# Altium schematic sheet 51小车.SchDoc
size A3
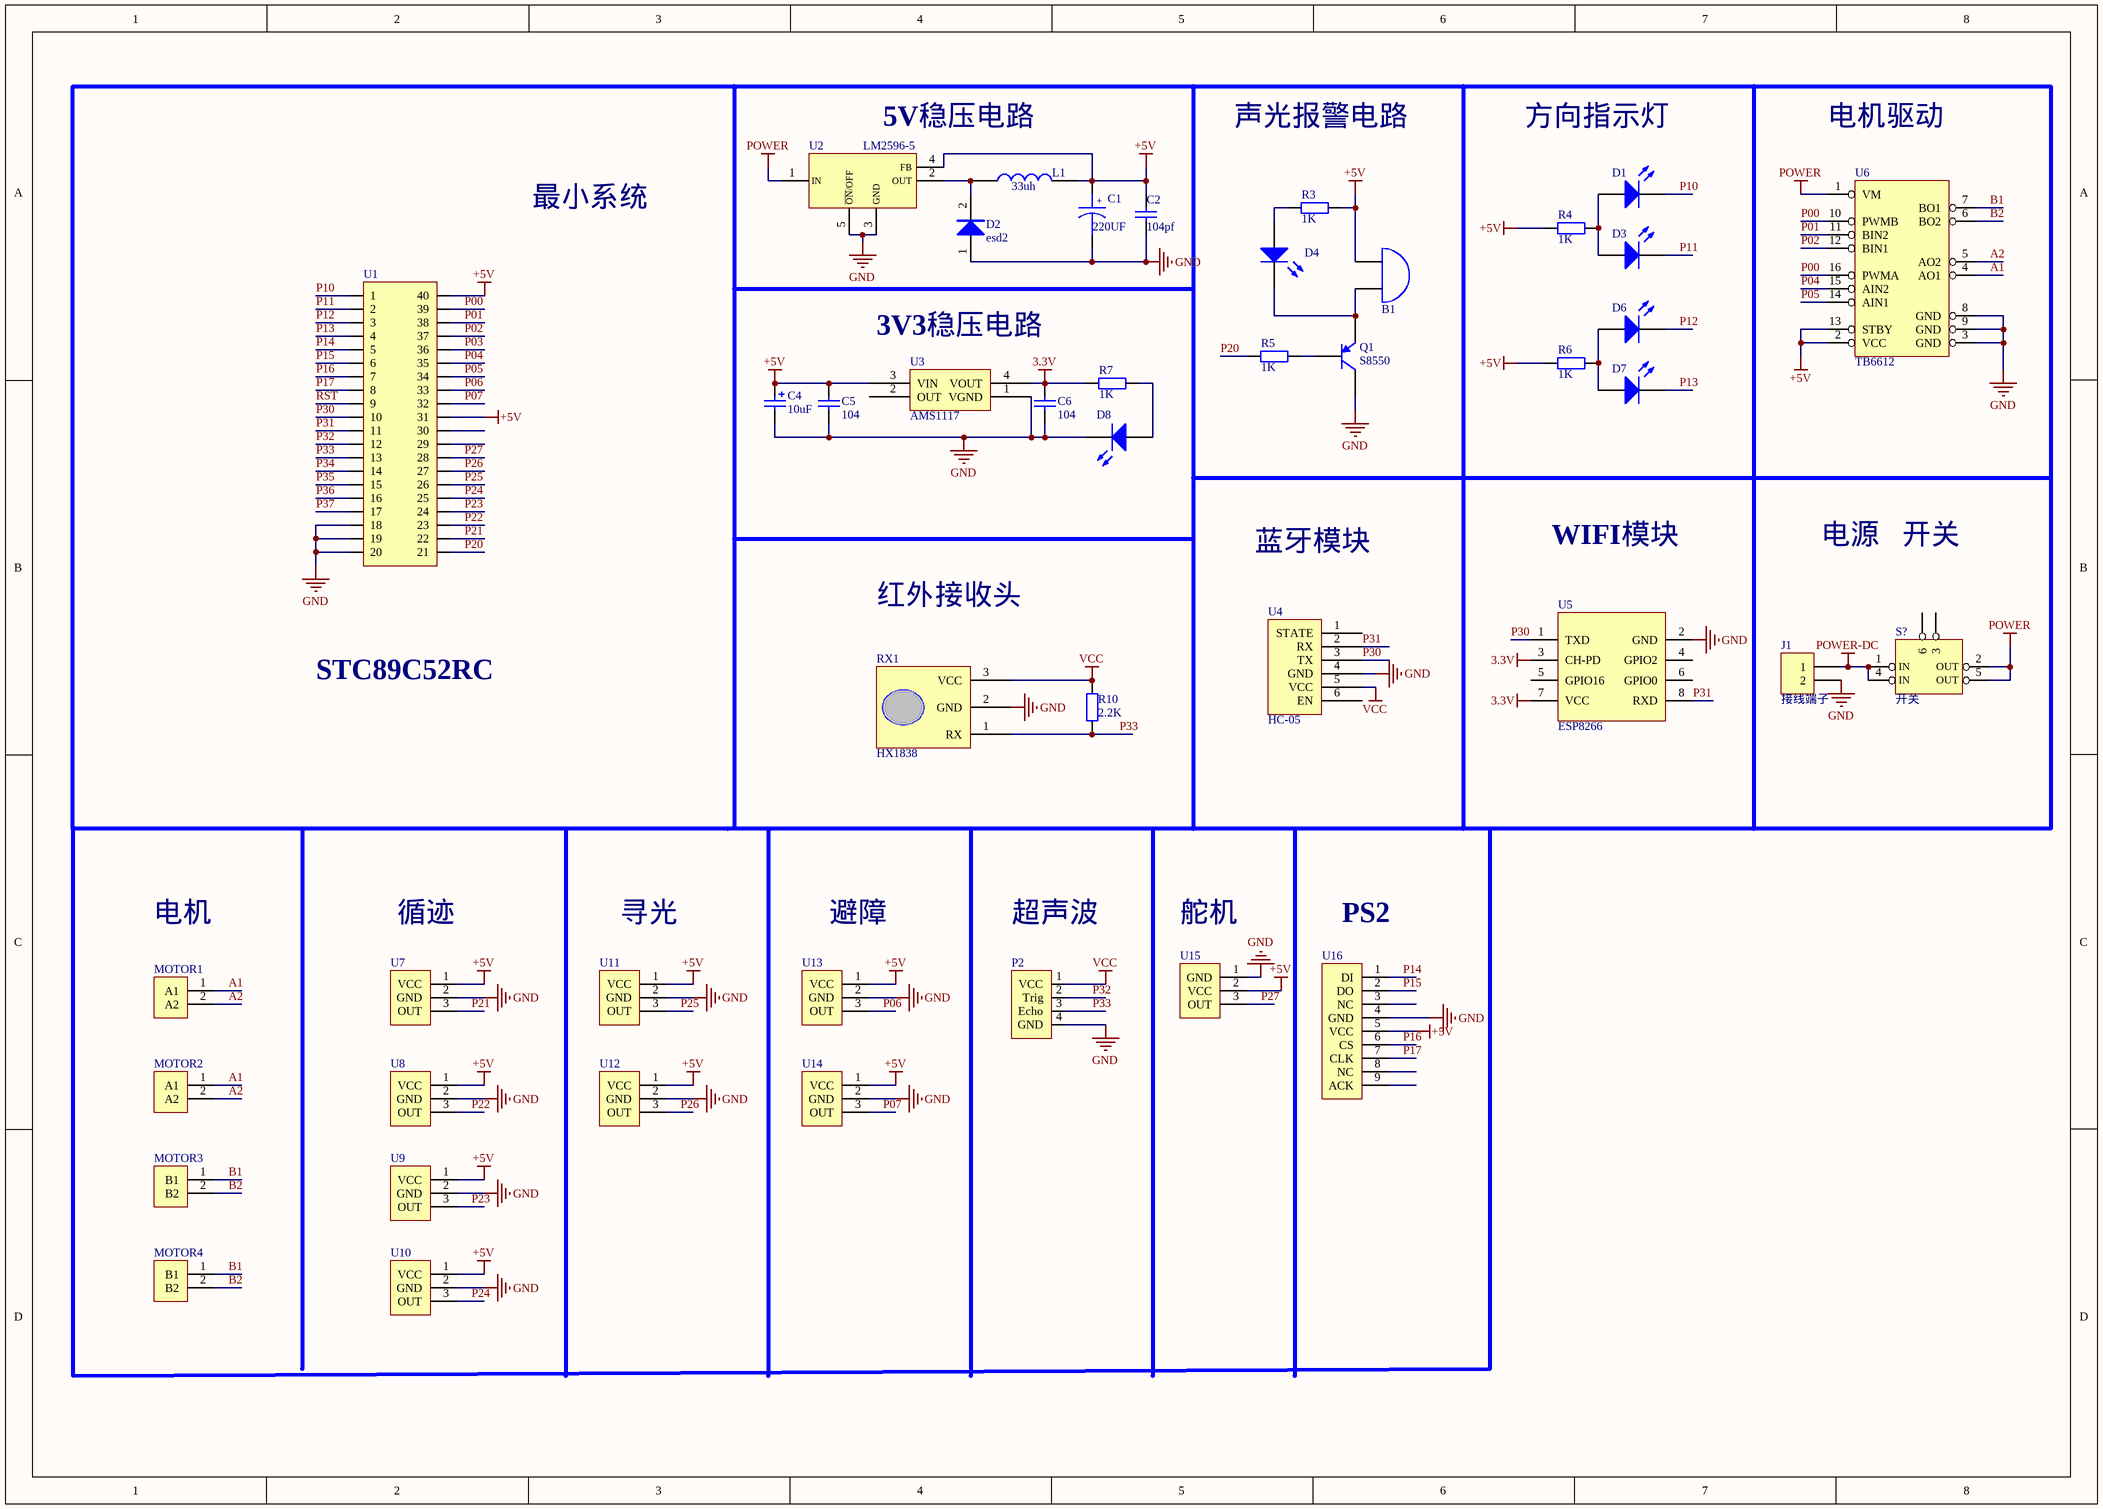
[diagram p0: 51小车.SchDoc]

## Parts
B1  5V有源蜂鸣器  [BEEP 7.6x12x7.5]  (value not drawn)
C1  CAP4 电解电容  [CAP6.3]  (value not drawn)
C2  Cap  [C 0603_L]  (value not drawn)
C4  value 10uF  [CAP 1.5*4*8 - BK]  (hidden comment: 10uf电解电容)
C5  value 104  [CC 2.2*5]  (hidden comment: 104瓷片电容)
C6  value 104  [CC 2.2*5]  (hidden comment: 104瓷片电容)
D1  3mm红色LED  [LED 3MM-R]  (value not drawn)
D2  esd2  [SMA]
D3  3mm红色LED  [LED 3MM-R]  (value not drawn)
D4  3mm蓝色LED  [LED 3MM-R]  (value not drawn)
D6  3mm红色LED  [LED 3MM-R]  (value not drawn)
D7  3mm红色LED  [LED 3MM-R]  (value not drawn)
D8  3mm红色LED  [LED 3MM-R]  (value not drawn)
J1  接线端子
L1  INDUCTOR 0  [CDRH74]  (value not drawn)
MOTOR1  2P端子  [XH2.54-WI-2P]  (value not drawn)
MOTOR2  2P端子  [XH2.54-WI-2P]  (value not drawn)
MOTOR3  2P端子  [XH2.54-WI-2P]  (value not drawn)
MOTOR4  2P端子  [XH2.54-WI-2P]  (value not drawn)
P2  超声波  [HDR2.54-M-LI-4P]  (value not drawn)
Q1  S8550  [TO92B]
R3  value 1K  [AXIAL0.4-1/4W]  (hidden comment: 1K直插色环电阻)
R4  value 1K  [AXIAL0.4-1/4W]  (hidden comment: 1K直插色环电阻)
R5  value 1K  [AXIAL0.4-1/4W]  (hidden comment: 1K直插色环电阻)
R6  value 1K  [AXIAL0.4-1/4W]  (hidden comment: 1K直插色环电阻)
R7  value 1K  [AXIAL0.4-1/4W]  (hidden comment: 1K直插色环电阻)
R10  value 2.2K  [AXIAL0.4-1/4W]  (hidden comment: 2.2K直插色环电阻)
RX1  HX1838  [TO92B]
S?  开关  [SWITCH_SELFLOCKING]
U1  40  (value not drawn)
U2  LM2596-5  [TO263-5A]
U3  AMS1117
U4  HC-05  [HDR2.54-M-LI-6P]
U5  ESP8266
U6  TB6612  [TB6612]
U7  红外避障模块  [HDR2.54-LI-3P]  (value not drawn)
U8  红外避障模块  [HDR2.54-LI-3P]  (value not drawn)
U9  红外避障模块  [HDR2.54-LI-3P]  (value not drawn)
U10  红外避障模块  [HDR2.54-LI-3P]  (value not drawn)
U11  红外避障模块  [HDR2.54-LI-3P]  (value not drawn)
U12  红外避障模块  [HDR2.54-LI-3P]  (value not drawn)
U13  红外避障模块  [HDR2.54-LI-3P]  (value not drawn)
U14  红外避障模块  [HDR2.54-LI-3P]  (value not drawn)
U15  舵机  (value not drawn)
U16  PS2  (value not drawn)

## Nets
3.3V: C6.2 R7.2 U3.4(VOUT) U5.3(CH-PD) U5.7(VCC)
+5V: B1.1(A) C1.1 C2.2 C4.1 C5.2 L1.2 R3.1 R4.2 R6.2 U1.31 U1.40 U2.4(FB) U3.3(VIN) U6.2(VCC) U6.13(STBY) U7.1(VCC) U8.1(VCC) U9.1(VCC) U10.1(VCC) U11.1(VCC) U12.1(VCC) U13.1(VCC) U14.1(VCC) U15.2(VCC) U16.5(VCC)
GND: C1.2 C2.1 C4.2 C5.1 C6.1 D2.1 D8.2(K) J1.2 P2.4(GND) Q1.2(C) RX1.2(GND) U1.18 U1.19 U1.20 U2.3(GND) U2.5(~{ON}/OFF) U3.1(VGND) U4.4(GND) U5.2(GND) U6.3(GND) U6.8(GND) U6.9(GND) U7.2(GND) U8.2(GND) U9.2(GND) U10.2(GND) U11.2(GND) U12.2(GND) U13.2(GND) U14.2(GND) U15.1(GND) U16.4(GND)
POWER: S?.2(OUT) S?.5(OUT) U2.1(IN) U6.1(VM)
POWER-DC: J1.1 S?.1(IN) S?.4(IN)
VCC: P2.1(VCC) R10.2 RX1.3(VCC) U4.5(VCC)
A1: MOTOR1.1(A1) MOTOR2.1(A1) U6.4(AO1)
A2: MOTOR1.2(A2) MOTOR2.2(A2) U6.5(AO2)
B1: MOTOR3.1(B1) MOTOR4.1(B1) U6.7(BO1)
B2: MOTOR3.2(B2) MOTOR4.2(B2) U6.6(BO2)
P00: U1.39 U6.10(PWMB) U6.16(PWMA)
P01: U1.38 U6.11(BIN2)
P02: U1.37 U6.12(BIN1)
P03: U1.36
P04: U1.35 U6.15(AIN2)
P05: U1.34 U6.14(AIN1)
P06: U1.33 U13.3(OUT)
P07: U1.32 U14.3(OUT)
P10: D1.2(K) U1.1
P11: D3.2(K) U1.2
P12: D6.2(K) U1.3
P13: D7.2(K) U1.4
P14: U1.5 U16.1(DI)
P15: U1.6 U16.2(DO)
P16: U1.7 U16.6(CS)
P17: U1.8 U16.7(CLK)
P20: R5.2 U1.21
P21: U1.22 U7.3(OUT)
P22: U1.23 U8.3(OUT)
P23: U1.24 U9.3(OUT)
P24: U1.25 U10.3(OUT)
P25: U1.26 U11.3(OUT)
P26: U1.27 U12.3(OUT)
P27: U1.28 U15.3(OUT)
P30: U1.10 U4.3(TX) U5.1(TXD)
P31: U1.11 U4.2(RX) U5.8(RXD)
P32: P2.2(Trig) U1.12
P33: P2.3(Echo) R10.1 RX1.1(RX) U1.13
P34: U1.14
P35: U1.15
P36: U1.16
P37: U1.17
RST: U1.9
NetB1_2: B1.2(B) D4.2(K) Q1.3(E)
NetD1_1: D1.1(A) D3.1(A) R4.1
NetD2_2: D2.2 L1.1 U2.2(OUT)
NetD4_1: D4.1(A) R3.2
NetD6_1: D6.1(A) D7.1(A) R6.1
NetD8_1: D8.1(A) R7.1
NetQ1_1: Q1.1(B) R5.1

Not connected (* = marked no-connect by the designer): S? 3 6; U1 29 30; U3 2(OUT); U4 1(STATE) 6(EN); U5 4(GPIO2) 5(GPIO16) 6(GPIO0); U16 3(NC) 8(NC) 9(ACK)

## Notes on the sheet
- 5V稳压电路
- 声光报警电路
- 方向指示灯
- 电机驱动
- 最小系统
- (near U3) 3V3稳压电路
- 蓝牙模块
- WIFI模块
- 电源   开关
- 红外接收头
- STC89C52RC
- 电机
- 循迹
- 寻光
- 避障
- 超声波
- (near U15) 舵机
- (near U16) PS2
- (in symbol Cap) 104pf
- (in symbol CAP4 电解电容) +; 220UF
- (in symbol INDUCTOR 0) 33uh

## Library data of the parts
B1 = BELL
C1 = CAP4 电解电容: Capacitor
C2 C5 C6 = Cap: Capacitor; Published: 8-Jun-2000; LatestRevisionDate: 17-Jul-2002; LatestRevisionNote: Re-released for DXP Platform.; PackageReference: RAD-0.3; Publisher: Altium Limited
  C5 C6: PackageDescription: Radial Cap, Thru-Hole; 2 Leads; 0.3 in Pin Spacing
C4 = Cap Pol2: Polarized Capacitor (Axial); Published: 8-Jun-2000; LatestRevisionDate: 17-Jul-2002; LatestRevisionNote: Re-released for DXP Platform.; PackageReference: POLAR0.8; Publisher: Altium Limited; PackageDescription: Polarized Capacitor; 2 Leads
D1 D3 D4 D6-D8 = LED1: Typical RED GaAs LED; Published: 8-Jun-2000; LatestRevisionDate: 08-Jul-2005; LatestRevisionNote: Mech Layer 1 removed.; PackageReference: LED-1; Publisher: Altium Limited
D2 = DIODE2
J1 MOTOR1 MOTOR2 = 2P
MOTOR3 MOTOR4 = 2P B
P2 = 4P
Q1 = PNP: PNP Bipolar Transistor; Published: 8-Jun-2000; LatestRevisionDate: 17-Jul-2002; LatestRevisionNote: Re-released for DXP Platform.; PackageReference: SOT-23B; Publisher: Altium Limited; Code_JEDEC: SOT-23
R3-R7 R10 = Res2: Resistor; Published: 8-Jun-2000; LatestRevisionDate: 17-Jul-2002; LatestRevisionNote: Re-released for DXP Platform.; PackageReference: AXIAL-0.4; Publisher: Altium Limited; PackageDescription: Axial Device, Thru-Hole; 2 Leads; 0.4 in Pin Spacing
RX1 = 1838
S? = switch
U2 = LM2560-5
U4 = Bluetooth
U5 = WIFI
U7-U14 = 红外避障